# EAGLE board FluoWiFi_R01-RC (EAGLE 8.2.2)
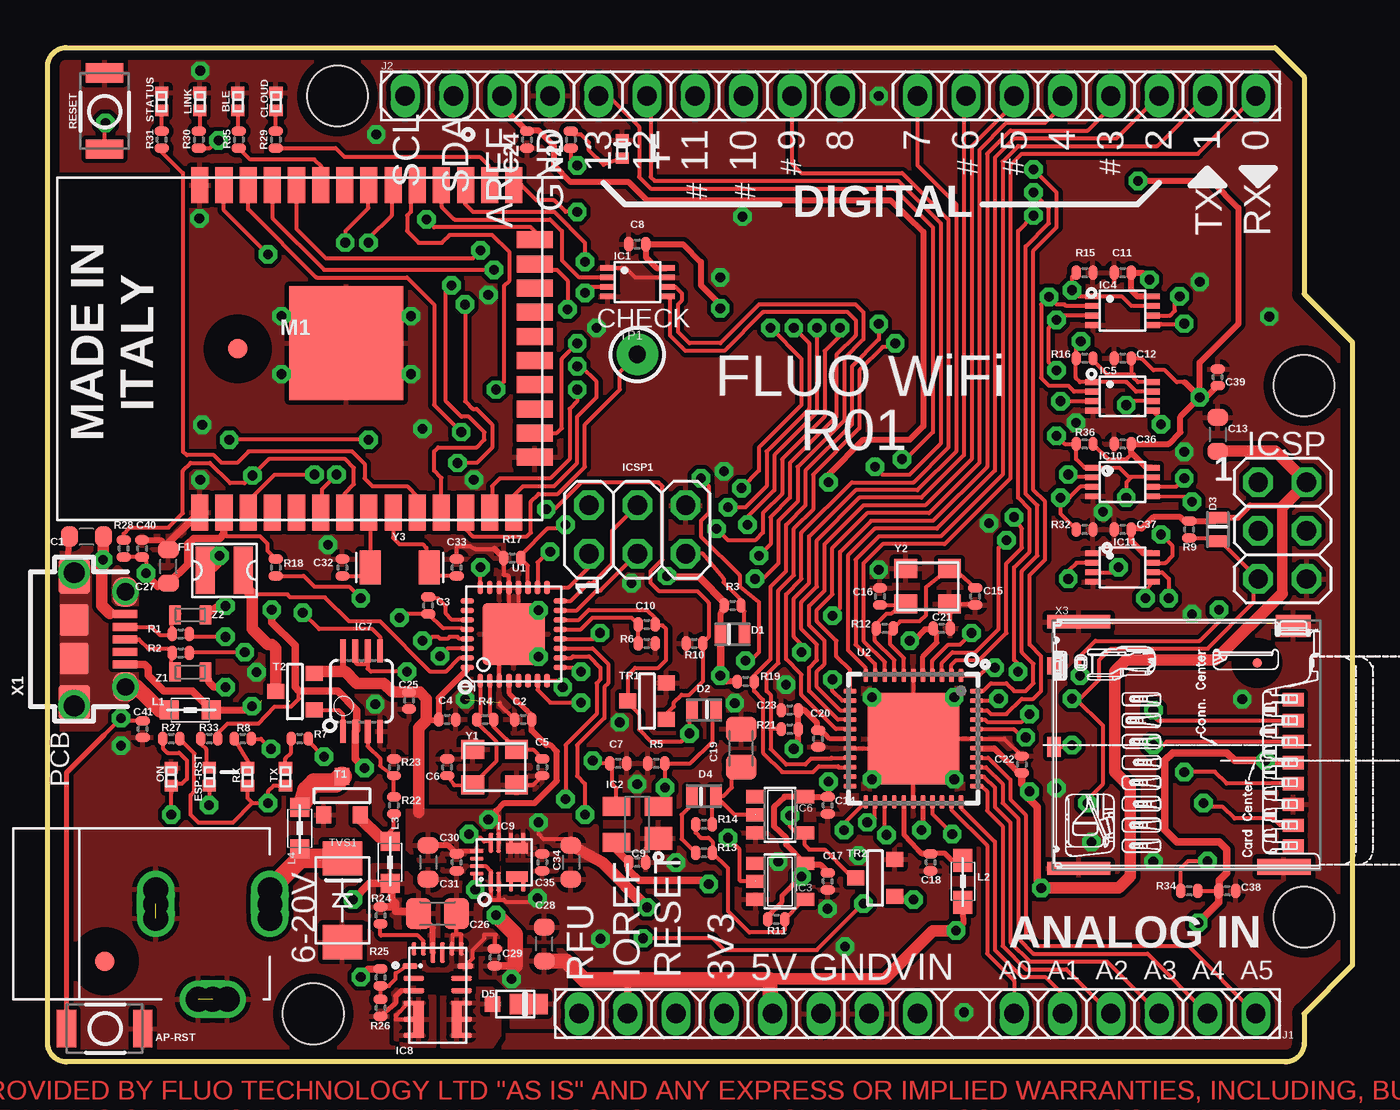
[diagram p2: board, top side]
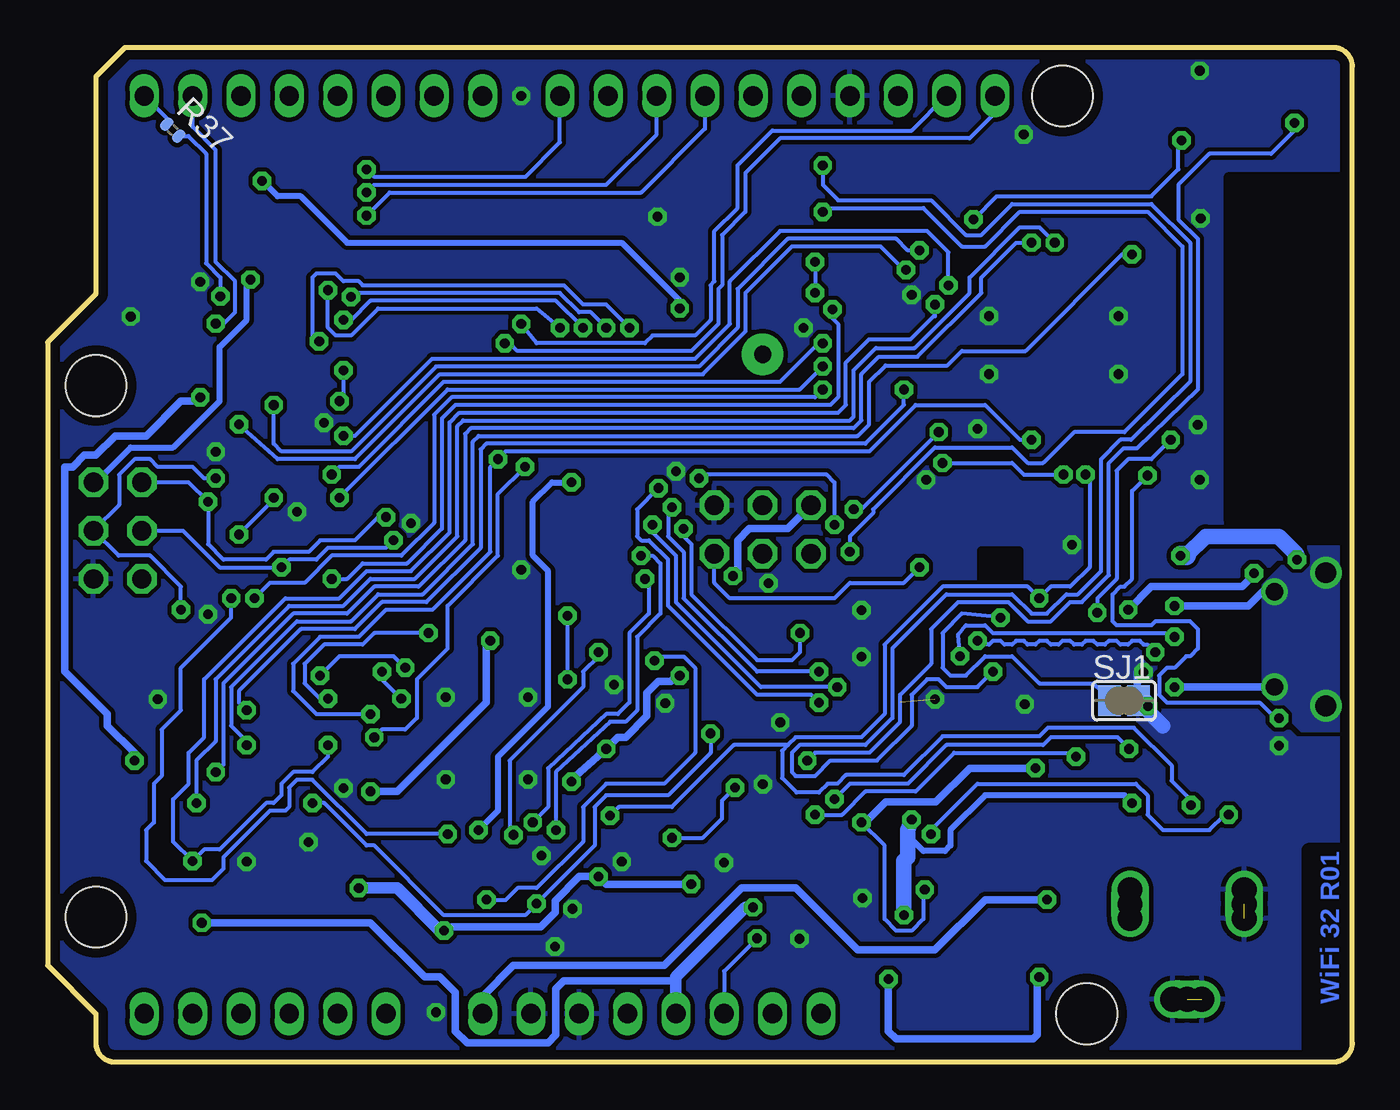
[diagram p3: board, bottom side, seen from below]

Size 68.58 x 53.34 mm. Coordinates in mm from the lower left corner, seen from the top.
Outline: 64.52,53.34 66.04,51.82 66.04,40.39 68.58,37.85 68.58,5.08 66.04,2.54 66.04,1 arc-90 65.04,0 1,0 arc-90 0,1 0,52.34 arc-90 1,53.34 64.52,53.34
Copper layers (1*16): Top 0.035mm / dielectric 1.5mm / Bottom 0.035mm
Design rules "ArduinoUno *": minimum track width 8mil, minimum drill 20mil, track to track 8mil, track to pad 8mil, pad to pad 8mil, via to via 8mil, smd to smd 8mil, copper to edge 20mil, drill to drill 12mil, minimum pad ring 10mil, minimum via ring 9mil, stop-mask expansion 2mil, vias tented up to drill 30mil, thermal gap 10mil
Net classes: 0 default: width 0.203 mm, drill 0.508 mm, clearance 0.203 mm; 1 power: width 0.61 mm, drill 0.508 mm, clearance 0.203 mm; 2 gnd: width 0.203 mm, drill 0.508 mm, clearance 0.203 mm; 3 usbvcc: width 0.305 mm, drill 0.508 mm, clearance 0.203 mm; 4 aref: width 0.305 mm, drill 0.508 mm, clearance 0.203 mm
Holes 3.2 mm at 66.04,35.56 66.04,7.62 15.24,50.8 13.97,2.54
bRestrict: 3 lines
vRestrict: area 22.9,44.1 to 24.6,49.1; area 25.4,45.5 to 27.1,49.1; area 28.4,45.3 to 29.6,48.8; area 31,45.3 to 32.1,48.8; area 33.5,45.3 to 34.7,48.8; area 36.1,45.3 to 37.2,48.8; area 38.7,47.2 to 39.9,48.8; area 40.3,45.1 to 47.6,46.9; area 60.3,44.2 to 61.7,46.7; area 62.9,44.2 to 64.3,46.7; area 61.3,35.8 to 64.8,37.2; area 0.6,21.8 to 2,30.1; area 5.7,22.6 to 7.4,30.1; area 47.9,10.3 to 48.5,10.8; area 50.4,10.2 to 50.9,11; area 11.3,28.8 to 12.7,31.1; area 44.8,47.5 to 46.1,48.9; area 47.6,47.4 to 48.8,48.9; area 50.2,47.4 to 51.3,48.9; area 52.8,47.4 to 54,48.9; area 55.2,47.4 to 56.4,48.9; area 57.9,47.4 to 59.1,48.9; area 60.5,47.4 to 61.6,48.9; area 63,47.4 to 64.1,48.9; area 41.3,47.2 to 42.4,48.8; area 0.3,12.4 to 9.4,24.5

## Footprints (pad centres in the part's own frame; a part is rotated, then mirrored left to right if it is on the bottom)
SMD_157SW = smd 1.016 x 1.981: 1 -2,0; 2 2.001,0
0402_CHIP_LED = smd 0.6 x 0.7: A 0.475,0; C -0.475,0
C0603-ROUND = smd 0.898 x 1.1: 1 -0.889,0; 2 0.889,0
C0402 = smd 0.508 x 0.762: 1 -0.445,0; 2 0.445,0
C0805_ROUND = smd 1.3 x 1.6: 1 -1,0; 2 1,0
0603 = smd 0.6 x 1: A 0.625,0; C -0.625,0
MICROSMP = smd 0.8 x 0.8: A 1.2,0 | smd 2 x 1.1: K -0.7,0
1210 = smd 1 x 2.5: 1 -1,0; 2 1,0
FIDUCIA-MOUNT = smd 1.016 x 1.016: P$1 0,0
MINI-FIDUCIAL = smd 0.508 x 0.508: P$1 0,0
VSSOP8 = smd 0.3 x 0.813: 1 -0.75,-1.55; 2 -0.25,-1.55; 3 0.25,-1.55; 4 0.75,-1.55; 5 0.75,1.55; 6 0.25,1.55; 7 -0.25,1.55; 8 -0.75,1.55
SOT143 = smd 1.2 x 1.44: 1 -0.75,-1.1 | smd 1 x 1.44: 2 0.95,-1.1; 3 0.95,1.1; 4 -0.95,1.1
SOT23-5 = smd 0.69 x 0.99: 1 -0.95,-1.29; 2 0,-1.29; 3 0.95,-1.29; 4 0.95,1.3; 5 -0.95,1.3
MSOP08 = smd 0.3 x 1.2: 1 -0.976,-2.113; 2 -0.326,-2.113; 3 0.324,-2.113; 4 0.974,-2.113; 5 0.974,2.112; 6 0.324,2.112; 7 -0.326,2.112; 8 -0.976,2.112
QFN-20 = smd 0.8 x 0.3: 1 -1.45,1.55; 12 1.45,1.55 | smd 1.1 x 0.275: 2 -1.25,0.9; 10 1.25,0.25; 11 1.25,0.9 | smd 1.1 x 0.25: 3 -1.25,0.25 | smd 0.7 x 0.25: 4 -1.45,-0.4; 5 -1.45,-1.25; 6 -1.45,-2.1; 7 1.45,-2.1; 8 1.45,-1.25; 9 1.45,-0.4 | smd 0.275 x 0.7: 13 1.25,2.45; 14 0.75,2.45; 17 -0.75,2.45; 18 -1.25,2.45 | smd 0.275 x 1.1: 15 0.25,2.25; 16 -0.25,2.25 | smd 0.6 x 1.95: 19 -1,-1.25; 20 1,-1.25
QFN-12 = smd 1.05 x 0.255: 1 -1.025,0.7; 2 -1.025,0.3; 7 1.025,0.3; 8 1.025,0.7 | smd 1.05 x 0.225: 3 -1.025,-0.35; 4 -1.025,-1; 5 1.025,-1; 6 1.025,-0.35 | smd 0.225 x 0.7: 9 0.6,1.45; 10 0.2,1.45; 11 -0.2,1.45; 12 -0.6,1.45 | smd 0.55 x 1.2: 13 -0.75,-0.675; 14 0.75,-0.675
2X03 = drill 1.016 pad 1.55 octagon: 1 -2.54,-1.27; 2 -2.54,1.27; 3 0,-1.27; 4 0,1.27; 5 2.54,-1.27; 6 2.54,1.27
1-14-TH-PRESSFIT = drill 1.02 pad 1.422 long: 1 16.51,0; 2 13.97,0; 3 11.43,0; 4 8.89,0; 5 6.35,0; 6 3.81,0; 7 1.27,0; 8 -1.27,0; 9 -6.35,0; 10 -8.89,0; 11 -11.43,0; 12 -13.97,0; 13 -16.51,0; 14 -19.05,0
1X18-TH-PRESSFIT = drill 1.02 pad 1.422 long: 1 24.384,0; 2 21.844,0; 3 19.304,0; 4 16.764,0; 5 14.224,0; 6 11.684,0; 7 9.144,0; 8 6.604,0; 9 4.064,0; 10 1.524,0; 11 -2.54,0; 12 -5.08,0; 13 -7.62,0; 14 -10.16,0; 15 -12.7,0; 16 -15.24,0; 17 -17.78,0; 18 -20.32,0
0805 = smd 1 x 1: 1 -1.1,0; 2 1.1,0
0805' = smd 1.2 x 1: 1 -1.1,0; 2 1.1,0
WROOM_ESP32 = smd 1.9 x 0.9: 1 0.4,18; 2 0.4,16.73; 3 0.4,15.46; 4 0.4,14.19; 5 0.4,12.92; 6 0.4,11.65; 7 0.4,10.38; 8 0.4,9.11; 9 0.4,7.84; 10 0.4,6.57; 11 0.4,5.3; 12 0.4,4.03; 13 0.4,2.76; 14 0.4,1.49; 25 17.604,1.49; 26 17.604,2.76; 27 17.604,4.03; 28 17.604,5.3; 29 17.604,6.57; 30 17.604,7.84; 31 17.604,9.11; 32 17.604,10.38; 33 17.604,11.65; 34 17.604,12.92; 35 17.604,14.19; 36 17.604,15.46; 37 17.604,16.73; 38 17.604,18 | smd 0.9 x 1.9: 15 3.3,0.4; 16 4.57,0.4; 17 5.84,0.4; 18 7.11,0.4; 19 8.38,0.4; 20 9.65,0.4; 21 10.92,0.4; 22 12.19,0.4; 23 13.46,0.4; 24 14.73,0.4 | smd 6 x 6: PAD 9.3,10.3
R0402 = smd 0.508 x 0.762: 1 -0.445,0; 2 0.445,0
SJ_NO_RESIST = smd 1.168 x 1.6: 1 -0.762,0; 2 0.762,0
SOT-23 = smd 0.787 x 0.889: 1 0.991,1.016; 2 -0.94,1.016; 3 0.025,-1.016
TEST_50 = smd 1.27 x 1.27: 1 0,0
SMA-TVS = smd 1.8 x 2.1: A -2.2,0; K 2.2,0
MLF32 = smd 0.7 x 0.28: 1 -2.45,1.75; 2 -2.45,1.25; 3 -2.45,0.75; 4 -2.45,0.25; 5 -2.45,-0.25; 6 -2.45,-0.75; 7 -2.45,-1.25; 8 -2.45,-1.75; 17 2.45,-1.75; 18 2.45,-1.25; 19 2.45,-0.75; 20 2.45,-0.25; 21 2.45,0.25; 22 2.45,0.75; 23 2.45,1.25; 24 2.45,1.75 | smd 0.28 x 0.7: 9 -1.75,-2.45; 10 -1.25,-2.45; 11 -0.75,-2.45; 12 -0.25,-2.45; 13 0.25,-2.45; 14 0.75,-2.45; 15 1.25,-2.45; 16 1.75,-2.45; 25 1.75,2.45; 26 1.25,2.45; 27 0.75,2.45; 28 0.25,2.45; 29 -0.25,2.45; 30 -0.75,2.45; 31 -1.25,2.45; 32 -1.75,2.45 | smd 3.254 x 3.254: 33 0,0
VQFN44 = smd 0.699 x 0.254: 1 -3.325,2.5; 2 -3.325,2; 3 -3.325,1.5; 4 -3.325,1; 5 -3.325,0.5; 6 -3.325,0; 7 -3.325,-0.5; 8 -3.325,-1; 9 -3.325,-1.5; 10 -3.325,-2; 11 -3.325,-2.5; 23 3.325,-2.5; 24 3.325,-2; 25 3.325,-1.5; 26 3.325,-1; 27 3.325,-0.5; 28 3.325,0; 29 3.325,0.5; 30 3.325,1; 31 3.325,1.5; 32 3.325,2; 33 3.325,2.5 | smd 0.254 x 0.699: 12 -2.5,-3.325; 13 -2,-3.325; 14 -1.5,-3.325; 15 -1,-3.325; 16 -0.5,-3.325; 17 0,-3.325; 18 0.5,-3.325; 19 1,-3.325; 20 1.5,-3.325; 21 2,-3.325; 22 2.5,-3.325; 34 2.5,3.325; 35 2,3.325; 36 1.5,3.325; 37 1,3.325; 38 0.5,3.325; 39 0,3.325; 40 -0.5,3.325; 41 -1,3.325; 42 -1.5,3.325; 43 -2,3.325; 44 -2.5,3.325 | smd 4.826 x 4.826: TH 0,0
CON2_USB_MICRO_B_AT_HOLES = smd 0.406 x 1.346: P1 -1.321,2.675; P2 -0.66,2.675; P3 0,2.675; P4 0.66,2.675; P5 1.321,2.675 | drill 0.9 pad 1.24: P$2 -2.5,2.7; P$7 2.5,2.7 | drill 1.1 pad 1.4: P$3 -3.5,0; P$6 3.5,0 | smd 1.778 x 1.651: S1 -3.302,0; S2 3.302,0 | smd 1.524 x 1.27: S3 -2.489,2.692; S4 2.489,2.692 | smd 1.626 x 1.524: S5 -1.016,0; S6 1.016,0
POWERSUPPLY_DC-21MM = drill 1.3 pad 2 long: 1 -5.08,-3.353; 2 -0.076,-6.35; 3 -0.076,-0.356 | drill 1.3: 4 -5.08,-4.115; 5 -5.08,-2.591; 6 -0.838,-0.356; 7 0.686,-0.356; 8 -0.838,-6.35; 9 0.686,-6.35; 10 -5.08,-3.353; 11 -0.076,-0.356; 12 -0.076,-6.35
20TW877_CARD_CONNECTOR = smd 1.14 x 1.83: GND1 6.26,-6 | smd 0.86 x 2.8: GND2 -6.4,-5.515 | smd 0.7 x 3.3: GND3 6.48,5.265; GND4 -6.48,5.265 | smd 0.7 x 1.1: P1 2.38,-6.015; P2 1.28,-6.015; P3 0.18,-6.015; P4 -0.92,-6.015; P5 -2.02,-6.015; P6 -3.12,-6.015; P7 -4.22,-6.015; P8 -5.32,-6.015 | smd 0.9 x 0.9: P9 4.17,6.465 | smd 1.05 x 0.7: P10 -0.095,6.565
CRYSTAL-3.2-2.5 = smd 1.2 x 1: 1 -1.15,-0.925; 2 1.15,-0.925; 3 1.15,0.925; 4 -1.15,0.925
RESONATOR_EPSON_FC_145 = smd 1.1 x 1.8: P$1 -1.55,0; P$2 1.55,0
CT/CN0603 = smd 0.6 x 1: 1 -0.797,0; 2 0.797,0

## Placement (x,y rotation side)
AP-RST  157SW  [SMD_157SW]  3,1.76 0 top
BLE  BLUE  [0402_CHIP_LED]  10,50.5 270 top
C1  22uF_6V3  [C0603-ROUND]  2.05,27.63 180 top
C2  100nF  [C0402]  25,18 180 top
C3  1uF  [C0402]  20,24 270 top
C4  100nF  [C0402]  21,18 180 top
C5  22pF  [C0402]  26,15.5 270 top
C6  22pF  [C0402]  21,15.5 90 top
C7  100nF  [C0402]  30,15.7 180 top
C8  100nF  [C0402]  31,43 0 top
C9  100nF  [C0402]  31,10.5 0 top
C10  100nF  [C0402]  31.5,23 0 top
C11  100nF  [C0402]  56.5,41.5 180 top
C12  100nF  [C0402]  56.5,37 180 top
C13  22uF_6V3  [C0603-ROUND]  61.5,33 270 top
C14  100nF  [C0402]  41,13.5 90 top
C15  22pF  [C0402]  48.75,24.48 270 top
C16  22pF  [C0402]  43.75,24.48 90 top
C17  100nF  [C0402]  41,9.5 90 top
C18  100nF  [C0402]  46.41,10.5 90 top
C19  10uF_16V  [C0805_ROUND]  36.45,16.5 90 top
C20  100nF  [C0402]  40.5,17 90 top
C21  100nF  [C0402]  47,22.8 180 top
C22  100nF  [C0402]  51.2,15.64 270 top
C23  1uF  [C0402]  39,18.5 180 top
C24  100nF  [C0402]  25.2,48.5 90 top
C25  100nF  [C0402]  19,19 90 top
C26  22uF_25V  [C0805_ROUND]  20.5,7.8 0 top
C27  22uF_6V3  [C0603-ROUND]  6.36,26.05 90 top
C28  22uF_6V3  [C0603-ROUND]  26.11,6.2 90 top
C29  100nF  [C0402]  23.5,5.5 90 top
C30  100nF  [C0402]  21.5,10.5 270 top
C31  22uF_6V3  [C0603-ROUND]  20,10.5 270 top
C32  22pF  [C0402]  15.5,26 90 top
C33  22pF  [C0402]  21.5,26 90 top
C34  22uF_6V3  [C0603-ROUND]  27.5,10.5 270 top
C35  100nF  [C0402]  26,10.5 90 top
C36  100nF  [C0402]  56.5,32.5 180 top
C37  100nF  [C0402]  56.5,28 180 top
C38  1uF  [C0402]  62,9 180 top
C39  1uF  [C0402]  61.5,36 270 top
C40  100nF  [C0402]  4.97,27 270 top
C41  22pF  [C0402]  5,17.5 270 top
CLOUD  WHITE  [0402_CHIP_LED]  12,50.5 270 top
D1  CD0603-SO1575  [0603]  36,22.5 0 top
D2  CD0603-SO1575  [0603]  34.5,18.5 180 top
D3  CD0603-SO1575  [0603]  61.5,28 270 top
D4  CD0603-SO1575  [0603]  34.5,14 0 top
D5  MSS1P3L-M3/89A  [MICROSMP]  24.59,3.05 180 top
DRILEGEND  [DRILEGEND]  73.44,45.84 0 top  (outside the outline)
ESP-RST  SUPER_RED  [0402_CHIP_LED]  8.5,15 90 top
F1  MF-USMF050-2  [1210]  9.3,25.85 180 top
FD1  FIDUCIALMOUNT  [FIDUCIA-MOUNT]  10,37.5 270 top
FD2  FIDUCIALMOUNT  [MINI-FIDUCIAL]  63.57,20.99 0 top
FD3  FIDUCIALMOUNT  [FIDUCIA-MOUNT]  3,5.3 0 top
IC1  74LVC2G125DC  [VSSOP8]  31,41 270 top
IC2  CAT811TTBI-GT3  [SOT143]  31,12.5 90 top
IC3  74LVC1G06DBV  [SOT23-5]  38.5,9.5 270 top
IC4  74LVC2G125DC  [VSSOP8]  56.5,39.5 270 top
IC5  74LVC2G125DC  [VSSOP8]  56.5,35 270 top
IC6  74LVC1G06DBV  [SOT23-5]  38.5,13 270 top
IC7  LMV358IDGKR  [MSOP08]  16.5,19.5 0 top
IC8  MPM3610  [QFN-20]  20.5,3.5 0 top
IC9  MPM3810GQB-33  [QFN-12]  24,10.5 90 top
IC10  74LVC2G125DC  [VSSOP8]  56.5,30.5 270 top
IC11  74LVC2G125DC  [VSSOP8]  56.5,26 270 top
ICSP  ICSP  [2X03]  64.9,27.94 270 top
ICSP1  ICSP  [2X03]  31,28 0 top
J1  FH254-114DF08500V  [1-14-TH-PRESSFIT]  44.45,2.54 180 top
J2  FH254-118DF08500V  [1X18-TH-PRESSFIT]  43.18,50.8 180 top
L  YELLOW  [0402_CHIP_LED]  30.2,48 270 top
L1  MH2029-300Y  [0805]  7.5,18.5 180 top
L2  10uH  [0805']  48.11,9.5 90 top
L3  MH2029-300Y  [0805]  18,10.5 270 top
L4  MH2029-300Y  [0805]  13.26,12.29 90 top
LINK  GREEN  [0402_CHIP_LED]  8,50.5 270 top
M1  ESP32_WROOM_MODULE  [WROOM_ESP32]  26,28.5 90 top
ON  GREEN  [0402_CHIP_LED]  6.5,15 270 top
R1  22R  [R0402]  7,22.5 0 top
R2  22R  [R0402]  7,21.5 0 top
R3  10K  [R0402]  36,24 180 top
R4  1M  [R0402]  23,18 0 top
R5  1M  [R0402]  32,15.7 0 top
R6  1K  [R0402]  31.5,22 180 top
R7  1K  [R0402]  13.25,17 180 top
R8  1K  [R0402]  10.25,17 180 top
R9  10K  [R0402]  60,28 90 top
R10  1M  [R0402]  34,22 180 top
R11  10K  [R0402]  38.3,7.5 180 top
R12  1M  [R0402]  44,22.8 0 top
R13  1K  [R0402]  34.5,11 180 top
R14  200K  [R0402]  34.5,12.5 180 top
R15  1M  [R0402]  54.5,41.5 180 top
R16  1M  [R0402]  54.5,37 180 top
R17  1M  [R0402]  24.42,26.49 180 top
R18  10K  [R0402]  12,26 90 top
R19  10K  [R0402]  36.69,20 180 top
R20  1K  [R0402]  27.5,48.5 270 top
R21  10K  [R0402]  39,17.5 0 top
R22  10K  [R0402]  18.2,13.5 270 top
R23  10K  [R0402]  18.2,15.5 270 top
R24  100k  [R0402]  17.5,7.7 270 top
R25  100k  [R0402]  17.5,4.45 90 top
R26  19K1  [R0402]  17.5,2.85 90 top
R27  1K  [R0402]  6.5,17 0 top
R28  10K  [R0402]  4,27 270 top
R29  1K  [R0402]  12,48.5 270 top
R30  390R  [R0402]  7.95,48.5 270 top
R31  390R  [R0402]  6,48.5 270 top
R32  1M  [R0402]  54.5,28 180 top
R33  390R  [R0402]  8.5,17 0 top
R34  100k  [R0402]  60,9 180 top
R35  390R  [R0402]  10.05,48.5 270 top
R36  1M  [R0402]  54.5,32.5 180 top
R37  1K  [R0402]  62,49 315 bottom
RESET  157SW  [SMD_157SW]  3,50 270 top
RX  YELLOW  [0402_CHIP_LED]  10.5,15 270 top
SJ1  [SJ_NO_RESIST]  12,19 0 bottom
STATUS  GREEN  [0402_CHIP_LED]  6,50.5 270 top
T1  IRLML9301TRPbF  [SOT-23]  15.5,14 180 top
T2  IRLML9301TRPbF  [SOT-23]  13,19.5 270 top
TP1  XXXX_TEST-POINTS_50  [TEST_50]  31,37.21 0 top
TR1  2N7002  [SOT-23]  31.5,19 270 top
TR2  2N7002  [SOT-23]  43.5,9.7 270 top
TVS1  SMAJ18A  [SMA-TVS]  15.5,8.5 90 top
TX  YELLOW  [0402_CHIP_LED]  12.5,15 270 top
U1  ATMEGA16U2-MU  [MLF32]  24.5,22.5 90 top
U2  ATmega644PA-MU  [VQFN44]  45.5,17 270 top
U$1  DISCLAIMER-FLUO  [DISCLAIMER-FLUO]  -18,-18.75 0 top  (outside the outline)
U$2  DISCLAIMER-FLUO  [DISCLAIMER-FLUO]  -18,-18.75 0 top  (outside the outline)
X1  USB MICRO  [CON2_USB_MICRO_B_AT_HOLES]  1.4,22.23 270 top
X2  POWER-SUPPLY  [POWERSUPPLY_DC-21MM]  5.33,8.38 90 top
X3  20TW877  [20TW877_CARD_CONNECTOR]  59.46,16.66 90 top
Y1  16Mhz-KX-7  [CRYSTAL-3.2-2.5]  23.5,15.5 0 top
Y2  16Mhz-KX-7  [CRYSTAL-3.2-2.5]  46.25,25.02 0 top
Y3  32,768Khz_SMD  [RESONATOR_EPSON_FC_145]  18.5,26 180 top
Z1  BRNCG0603MLC-05E  [CT/CN0603]  7.5,20.5 0 top
Z2  BRNCG0603MLC-05E  [CT/CN0603]  7.5,23.5 0 top

## Tracks (layer width: path | path; a pad name or v marks a point on that pad's centre or on a via)
5VEN
  Top 0.203: IC8.17 19.75,6.36 19.46,6.66 17.53,6.66 17.48,6.71 17.48,7.23 R24.2
16U2RXD  (via drill 0.51, 0.51 pad 0.61)
  Top 0.203: v40.44,38.61 40.44,34.14 38.2,31.9 38.2,30.07 36.78,28.65 v36.78,28.25 | U1.8 26.74,20.05 v27.08,19.71 | IC4.3 53.32,39.25 v53.03,39.01 52.63,38.61 52.63,36.78 v53.03,36.37 | v53.24,34.75 IC5.3
  Bottom 0.203: v36.78,28.25 36.78,27.84 35.56,26.62 35.56,24.18 31.09,19.71 v27.08,19.71 | v40.44,38.61 41.86,40.03 51.61,40.03 52.63,39.01 v53.03,39.01 | v53.03,36.37 53.03,34.75 v53.24,34.75
16U2TOATMEGAEN  (via drill 0.51)
  Top 0.203: v41.66,38.61 41.86,38.41 40.84,37.39 40.84,33.93 38.61,31.7 38.61,29.87 37.59,28.85 37.59,27.84 37.19,27.43 35.76,27.43 v35.15,28.04 | U1.12 28.74,22.25 v29.04,22.55 | IC4.7 56.97,39.75 56.49,40.23 54.97,40.23 IC4.1 54.18,40.25 v53.85,40.58 53.85,41.29 R15.2
  Bottom 0.203: v35.15,28.04 35.15,27.64 34.75,27.23 34.75,24.59 31.29,21.13 29.45,21.13 29.04,21.54 v29.04,22.55 | v41.66,38.61 42.88,39.62 51.21,39.62 52.63,38.2 53.44,38.2 53.85,38.61 v53.85,40.58
16U2TOESPEN  (via drill 0.51)
  Top 0.203: v38,38.61 39.62,36.98 39.62,34.54 37.39,32.31 37.39,31.09 v36.47,30.18 | U1.7 25.75,19.56 26.42,18.9 v28.04,18.9 | 54.36,37.9 v54.3,37.9 54.06,37.65 R16.2 54.05,35.97 54.27,35.75 IC5.1 56.68,35.75 56.69,35.76 57.21,35.25 IC5.7
  Bottom 0.203: v28.04,18.9 28.45,19.3 31.29,19.3 35.97,23.98 35.97,26.42 36.98,27.43 37.39,27.43 37.59,27.64 37.59,29.06 v36.47,30.18 | v38,38.61 39.22,39.83 40.44,39.83 41.45,40.84 52.02,40.84 52.22,41.05 53.03,41.05 53.44,41.45 54.46,41.45 54.66,41.25 54.66,38.15 v54.3,37.9
16U2TXD  (via drill 0.51)
  Top 0.203: U1.9 27.82,20.75 v28.04,20.52 | v39.22,38.61 40.03,37.8 40.03,34.34 37.8,32.11 37.8,30.28 36.68,29.16 v35.76,29.16 | IC4.2 53.52,39.75 53.44,39.83 53.03,39.83 v52.63,40.23 52.22,39.83 52.22,35.97 52.63,35.56 53.65,35.56 53.95,35.25 IC5.2
  Bottom 0.203: 52.85,40.23 v52.63,40.23 52.43,40.44 41.66,40.44 40.64,39.42 40.03,39.42 v39.22,38.61 | v35.76,29.16 35.97,28.96 35.97,27.64 35.15,26.82 35.15,24.38 31.29,20.52 v28.04,20.52
644RX5  (via drill 0.51)
  Top 0.203: v37.19,25.4 37.59,25.4 38.41,26.21 38.41,28.45 39.42,29.46 39.42,31.29 41.86,33.73 41.86,36.98 42.88,38 42.88,39.42 42.47,39.83 37.39,39.83 35.36,37.8 33.73,37.8 33.12,38.41 33.12,39.83 33.33,40.03 33.33,40.44 33.01,40.75 IC1.6 | v43.08,12.6 43.28,12.6 43.48,12.8 43.48,13.66 U2.24
  Bottom 0.203: v37.19,25.4 36.98,25.2 36.98,23.57 38,22.55 38,18.9 38.61,18.29 39.22,18.29 42.27,15.44 42.27,13.41 v43.08,12.6
644TX5  (via drill 0.51)
  Top 0.203: v37.39,26.62 38,27.23 38,28.65 39.01,29.67 39.01,31.5 41.45,33.93 41.45,37.19 42.47,38.2 42.47,39.01 42.06,39.42 37.59,39.42 35.56,37.39 33.53,37.39 32.72,38.2 32.72,40.09 IC1.5 | v41.86,12.19 41.86,12.53 U2.23
  Bottom 0.203: v37.39,26.62 36.78,26.62 36.37,26.21 36.37,23.57 37.59,22.35 37.59,18.49 38.2,17.88 39.01,17.88 41.86,15.24 v41.86,12.19
+3V3  (via drill 0.51)
  Top 0.203: R28.2 | 27.5,11.72 26.08,11.72 25.81,11.99 v25.81,12.6 | IC9.14 24.62,11.25 IC9.6 | IC9.12 22.45,9.9 22.45,9.09 v22.48,9.07 | R28.2 C40.2 5.18,26.34 v5.18,25.7 | R34.1 C38.2 | IC5.8 57.32,35.75 57.1,35.97 57.1,36.17 56.9,36.17 | R16.1 54.94,36.9 55.68,36.17 56.9,36.17 | 56.9,36.17 56.94,36.22 C12.1 56.96,36.98 57.51,36.98 58.12,36.37 58.73,36.37 59.35,35.75 59.75,35.75 | 9.27,27.76 9.4,27.64 11.18,27.64 11.56,27.26 11.56,26.89 R18.2 | 13.21,19.51 13.21,19.1 12.8,18.69 11.94,18.69 11.07,17.78 9.45,17.78 8.94,17.28 R33.2 | R36.1 55.74,31.7 56.69,31.7 57,32
  Top 0.305: C34.1 27.5,11.72 | 16.26,17.47 IC7.2 | v57.3,46.33 61.16,46.33 62.59,44.91 62.59,38.81 60.55,36.78 v60.55,34.95 | C39.2 60.91,35 v60.55,34.95 | v60.55,34.95 59.54,33.93 59.54,33.12 58.92,32.5 C36.1 56.94,32.06 57,32 57.75,31.25 IC10.8 | X3.P4 64.11,15.74 v64.01,15.85 | v35.36,39.62 35.36,39.83 34.34,40.84 34.34,42.06 33.4,43 C8.2 31.45,42.32 32.01,41.75 IC1.8 | 59.75,35.75 v60.55,34.95
  Top 0.406: 16.26,17.47 16.26,18.49 15.24,19.51 13.21,19.51 13.01,19.71 13.01,21.89 11.79,23.11 v11.79,23.77 | v5.18,25.7 5.18,25.6 5.79,25 C27.1 7.37,26.16 7.37,27.23 7.67,27.53 9.04,27.53 9.27,27.76 M1.2 | IC7.2 16.17,15.93 v16.66,15.44 | 63.8,15.85 v64.01,15.85 62.38,15.85 61.98,16.26 59.13,16.26 58.73,15.85 58.73,12.19 59.33,11.58 61.57,11.58 61.98,11.18 61.98,9.96 61.57,9.55 61.57,8.99 C38.2 61.56,8.39 v60.48,7.32
  Top 0.61: C34.1 29.14,10.48 v31.5,8.13
  Bottom 0.203: v22.48,9.07 22.55,8.99 22.55,7.52 23.16,6.91 23.98,6.91 24.59,7.52 24.59,11.38 v25.81,12.6
  Bottom 0.305: v57.3,46.33 56.49,45.52 55.27,45.52 52.83,43.08 38.41,43.08 35.36,40.03 v35.36,39.62
  Bottom 0.406: v11.79,23.77 10.57,24.99 5.79,24.99 5.18,25.6 v5.18,25.7 | v60.48,7.32 51.61,7.32 48.77,4.47 47.95,4.47 47.14,3.66 47.14,1.63 46.53,1.02 42.27,1.02 41.86,1.42 41.86,3.86 41.45,4.27 35.76,4.27 35.56,4.06 | v25.81,12.6 25.6,12.6 24.54,13.66 21.89,13.66 20.12,15.44 v16.66,15.44 | v64.01,15.85 64.01,16.26 65.43,17.68 65.43,18.29 67.67,20.52 67.67,31.29 67.26,31.29 66.65,31.9 66.04,31.9 65.02,32.92 63.4,32.92 61.57,34.75 60.76,34.75 v60.55,34.95
  Bottom 0.61: J1.4 35.56,4.06 35.56,4.47 31.9,8.13 v31.5,8.13
  pour Top (isolate 0.203, rank 2): 24.18,13 28.24,13 28.85,12.4 28.85,10.57 24.18,10.57
+5V  (via drill 0.51)
  Top 0.203: 7.08,16.87 R27.2 7.72,16.22 7.72,14.22 7.52,14.02 7.52,13.01 7.92,12.6 9.75,12.6 10.77,13.61 | 11.61,13.64 v11.58,13.61 | RX.A 10.5,13.88 10.77,13.61 | 10.77,13.61 v11.58,13.61 | TX.A 11.88,14.53 11.58,14.22 v11.58,13.61
  Top 0.229: IC9.7 23.7,12.88
  Top 0.254: 23.7,12.88 23.57,13.01 23.16,13.01 | U2.5 46,21.31 46.74,22.05 46.74,22.62 C21.2 | U2.17 41.12,17 40.84,17.27 40.67,17.27 C20.2 | U1.4 24.25,19.41 25.2,18.49 25.45,18.24 C2.1 | R11.2 37.85,7.68 38.61,8.43 38.61,8.74 v39.62,9.75 | C30.1 21.66,11.1 IC9.9
  Top 0.305: 64.95,29.26 63.2,29.26 62.56,28.62 D3.C 61.32,28.45 R9.2 59.74,28.45 59.54,28.65 58.11,28.65 57.51,28.04 56.99,28.04 C37.1 56.94,27.38 57.58,26.75 IC11.8 | U1.32 22.05,20.63 20.55,19.13 C4.2 20.52,17.97 19.91,17.97 | U2.38 49.74,16.5 51,15.24 C22.2 | v45.31,22.15 45.52,22.15 46.13,22.76 46.51,22.76 C21.2 | v39.22,16.46 39.42,16.66 39.42,17.48 R21.2 C23.1 39.77,18.5 40.44,17.82 40.44,17.5 C20.2 | R19.2 35.68,20 35.38,20.3 v35.36,20.32 | 23.57,13.01 23.57,13.21 23.98,13.61 25.6,13.61 26.77,14.78 26.77,16.31 26.42,16.66 26.21,16.66 25.45,17.43 C2.1 | v41.05,14.73 41.05,13.94 C14.2 IC6.5 38.74,13.95 38.18,13.41 38.18,12.39 38.81,11.79 38.81,11.44 IC3.5 | D1.C 35.38,23.52 R3.2 | v57.91,41.14 57.55,41.5 C11.1 56.94,40.59 57.29,40.25 IC4.8 | v47.75,6.91 48.14,7.32 L2.1 | C30.1 21.05,11.39 C31.1 | v39.62,9.75 39.62,10.27 IC3.5 | C17.2 41,10 40.64,10.36 39.89,10.36 IC3.5 | IC3.5 | IC7.8 15.52,20.6 15.44,20.52
  Top 0.406: 64.95,29.26 ICSP.2 | v16.46,4.47 16.86,4.88 R25.2 | J1.2 30.48,4.27 28.19,4.32 | C29.1 24.56,5.06 24.59,5.08 | v23.16,12.75 23.16,13.01 | IC2.4 29.9,11.15 C9.1 30.55,10.09 31.09,9.55 34.54,9.55 v34.75,9.35 | C22.2 51.2,14.63 v51.61,14.22 51.61,13.82 52.02,13.41 52.02,9.55 52.22,9.35 v52.22,9.14 | 35.38,20.3 D1.C | v32.56,25.55 32.61,25.55 32.66,25.5 34.24,25.5 35.65,24.09 R3.2
  Top 0.559: 64.9,24.64 64.9,29.18
  Top 0.61: 37.95,4.32 38.1,4.37 43.99,4.37 46.53,6.91 v47.75,6.91 | v52.22,9.14 56.29,9.14 56.9,9.75 56.9,14.43 56.08,15.24 56.08,20.52 56.69,21.13 61.37,21.13 64.9,24.64 | 64.9,29.18 ICSP.2 64.54,32.11 C13.2 | 19.51,13.13 19.51,17.56 19.91,17.97 19.91,19.1 19.57,19.45 C25.2 18.15,19.45 17.68,19.91 16.26,19.91 15.65,20.52 15.44,20.52 14.1,20.52 T2.2
  Top 0.813: C28.1 27.25,5.3 28.19,4.32 37.95,4.32 38,2.64 J1.5 | 24.59,5.08 24.59,6.71 v23.57,7.72
  Bottom 0.305: v11.58,13.61 11.99,14.02 19.3,14.02 21.13,12.19 21.13,11.38 21.41,11.1 IC9.9 23.16,11.71 v23.16,12.75 | ICSP1.2 28.46,29.25 | v57.91,41.14 58.12,40.94 58.12,39.01 59.54,37.59 59.54,34.75 61.98,32.31 64.21,32.31 66.04,30.48
  Bottom 0.406: v24.38,4.37 24.38,1.63 23.98,1.22 16.76,1.22 16.56,1.42 16.56,4.37 v16.46,4.47 | v47.75,6.91 47.35,7.11 42.67,7.11 41.91,7.87 41.91,8.48 40.64,9.75 v39.62,9.75 39.22,9.35 v34.75,9.35 | v51.61,14.22 50.19,14.22 45.52,18.9 45.52,21.95 v45.31,22.15 | 28.46,29.25 29.67,28.04 31.7,28.04 32.31,27.43 32.31,25.81 v32.56,25.55 | v35.36,20.32 35.52,20.32 35.84,20 36.49,20 37.08,19.41 37.08,18.19 38.2,17.07 38.61,17.07 v39.22,16.46 41.05,14.83 v41.05,14.73 | ICSP.2 66.04,30.48
  Bottom 0.61: v52.22,9.14 50.19,9.14 47.95,6.91 v47.75,6.91
  Bottom 0.813: v23.57,7.72 23.57,10.57 23.37,10.77 23.37,12.19 v23.16,12.75
  pour Top (rank 2): 22.76,5.49 24.18,5.49 24.59,5.89 27.03,5.89 27.23,5.69 27.23,1.83 24.38,1.83 24.38,3.66 23.62,4.42 22.76,4.42
  pour Top (isolate 0.203): 18.9,13.21 18.9,11.2 19.53,10.57 20.93,10.57 21.13,10.36 23.77,10.36 23.77,13.21
+5V_SEZ
  pour Top (isolate 0.203): 20.73,3.86 20.73,0.81 23.37,0.81 23.77,1.42 23.77,3.45 23.37,3.86
++VIN  (via drill 0.51)
  Top 0.305: IC8.16 20.25,7.05 C26.1
  Top 0.406: R24.1 18.27,8.15 18.29,7.92 | 18.29,7.92 18.29,8.33 18.09,8.53 18.09,9.31 L3.2 16.92,9.4 v16.05,8.53 | 19.1,7.92 18.29,7.92
  Top 0.61: C26.1 19.22,7.8 19.1,7.92
  Bottom 0.406: J1.8 45.72,3.45 44.09,5.08 36.17,5.08 32.11,9.14 29.26,9.14 26.01,5.89 21.95,5.89 19.3,8.53 v16.05,8.53
  pour Top: 17.07,10.36 18.47,10.36 19.1,9.73 19.1,9.35 19.71,8.74 20.12,8.74 20.52,8.33 20.52,6.3 20.32,6.1 20.12,6.1 19.91,6.3 19.91,6.71 19.71,6.91 18.49,6.91 18.29,7.11 18.29,7.52 18.08,7.72 17.07,7.72
+VIN
  Top 0.203: L3.1 17.98,12.09 18.2,12.31 R22.2
  Top 0.61: T1.2 16.44,12.82 17.48,11.79 17.82,11.6 L3.1
AD0
  Top 0.203: U2.32 47.5,13.26 49.38,11.38 49.38,5.69 50.8,4.27 J1.9
AD1
  Top 0.203: U2.33 48,13.37 49.78,11.58 49.78,5.89 51.21,4.47 52.43,4.47 53.24,3.66 53.24,2.64 J1.10
AD2
  Top 0.203: U2.34 49.1,14.5 49.38,14.22 49.38,13.21 50.19,12.39 50.19,6.1 51.41,4.88 53.54,4.88 J1.11
AD3
  Top 0.203: U2.35 49.21,15 49.78,14.43 49.78,13.41 50.6,12.6 50.6,6.3 51.61,5.28 55.68,5.28 J1.12
AD4
  Top 0.203: U2.36 49.32,15.5 50.19,14.63 50.19,13.61 51,12.8 51,6.5 51.82,5.69 57.81,5.69 J1.13
AD5
  Top 0.203: U2.37 49.43,16 50.6,14.83 50.6,13.82 51.41,13.01 51.41,6.71 52.02,6.1 59.94,6.1 J1.14
AREF  (via drill 0.51)
  Top 0.254: U2.29 46,12.32 v45.92,12.19
  Top 0.305: 23.88,50.27 C24.2 | v41.05,30.48 41.05,30.89 42.88,32.72 45.31,32.72 46.02,33.43 46.02,43.64 44.3,45.31 31.5,45.31 30.53,46.28 27.48,46.28 26.62,47.14 26.62,48.16 25.81,48.97 25.23,48.97
  Top 0.406: J2.3 23.88,50.27 | 25.23,48.97 C24.2
  Bottom 0.305: 46.13,12.19 v45.92,12.19 44.91,13.21 44.91,16.05 42.27,18.69 42.27,25.81 43.08,26.62 43.08,29.46 42.06,30.48 v41.05,30.48
ATMEGAINT3  (via drill 0.51)
  Top 0.203: 55.03,26.25 IC11.2 54.09,26.25 53.65,25.81 v53.65,25.4 | 25.5,41.96 M1.23 25.9,41.66 26.77,41.66 27.33,41.1 v27.33,39.57
  Bottom 0.203: v53.65,25.4 52.83,25.4 52.02,26.21 49.68,26.21 47.85,28.04 47.85,33.83 47.14,34.54 27.43,34.54 27.03,34.95 27.03,38.81 27.33,39.12 v27.33,39.57
ATMEGARESET  (via drill 0.51)
  Top 0.203: R9.1 61.32,27.55 D3.A 61.65,27.38 ICSP.5 63.4,25.17 63.4,24.18 60.98,21.74 55.88,21.74 55.27,21.13 55.27,20.12 54.25,19.1 54.05,19.1 | U2.4 46.5,21.1 47.35,21.95 47.95,21.95 v48.56,22.55 | 33.85,18.02 D2.A 33.88,18.35 33.73,18.09 v33.73,17.27 33.33,16.87 31.7,16.87 31.09,17.48 31.09,18.29 30.59,18.79 TR1.3 30.57,18.99 30.48,19.1 30.48,20.32 30.89,20.73 32.11,20.73 32.51,21.13 32.51,22.76 32.31,22.96 31.98,22.96 C10.2 31.9,23.04 31.9,23.37 31.5,23.77 28.45,23.77 27.92,23.25 U1.14 | v54.66,13.61 54.66,13.82 55.47,14.63 55.47,17.68 54.05,19.1 | v53.85,19.1 54.05,19.1 | v42.88,8.33 40.44,5.89 35.56,5.89 34.95,6.5 v31.29,6.5
  Bottom 0.203: v54.66,13.61 54.05,13.61 51.82,11.38 51.41,11.38 47.75,7.72 43.48,7.72 v42.88,8.33 39.83,11.38 39.83,13.41 39.22,14.02 35.97,14.02 33.73,16.26 v33.73,17.27 | v48.56,22.55 51.41,22.55 52.02,21.95 54.05,21.95 55.07,20.93 55.07,19.91 54.25,19.1 v53.85,19.1 | v31.29,6.5 33.02,4.78 J1.3
ATMEGARSTCMD  (via drill 0.51)
  Top 0.203: TR1.1 32.22,18 32.92,18.69 32.92,18.9 33.33,19.3 33.73,19.3 34.44,20.02 R10.1 34.58,22.19 34.75,22.35 34.75,24.16 34.16,24.74 32.16,24.74 31.7,25.2 31.7,25.81 32.31,26.42 32.31,30.28 32.11,30.48 28.04,30.48 26.62,29.06 v26.21,29.06 | 10.54,45.75 M1.36 10.54,44.83 14.12,41.25 18.9,41.25 20.32,39.83 20.32,34.54 v21.74,33.12
  Bottom 0.203: v26.21,29.06 25.81,29.06 v21.74,33.12
ATMEGINT  (via drill 0.51)
  Top 0.203: U2.30 46.5,13.04 v47.55,11.99 | 57.86,25.75 IC11.6 58.58,25.75 58.93,25.4 v58.93,24.38
  Bottom 0.203: v47.55,11.99 51.82,11.99 54.66,14.83 55.47,14.83 55.88,14.43 55.88,13.41 56.08,13.21 56.9,13.21 59.33,10.77 59.33,10.16 59.94,9.55 62.38,9.55 63.4,10.57 63.4,12.19 62.99,12.6 62.99,14.63 62.59,15.04 62.59,17.48 61.57,18.49 61.57,20.73 58.93,23.37 v58.93,24.38
AVCC
  Top 0.203: L2.2 47.5,10.62
  Top 0.254: U2.27 45,11.94 45.72,11.18 45.95,10.94 C18.2 46.03,10.97 47.14,10.97 47.5,10.62
BLELED
  Top 0.203: R35.2 10.66,47.45 14.02,47.45 14.38,47.09 14.38,46.13 M1.33
BUTTON  (via drill 0.51)
  Top 0.203: 2.98,17.2 v3.86,18.09 4,17.95 C41.1 | R28.1 4,27.77 4.32,28.09 6.35,28.09 7.11,28.85 7.11,31.09 7.52,31.5 8.53,31.5 9.6,30.43 10.36,30.43 v10.77,30.84 11.63,31.7 15.65,31.7 16.1,31.24 16.1,30.38 15.62,29.89 M1.7
  Top 0.254: AP-RST.1 1,15.22 2.98,17.2
  Bottom 0.203: v3.86,18.09 4.06,18.09 4.88,18.9 9.75,18.9 10.16,19.3 10.16,20.32 9.75,20.73 9.35,20.73 8.74,21.34 8.53,21.34 8.13,21.74 8.13,22.76 8.53,23.16 10.36,23.16 10.57,22.96 12.39,22.96 12.6,23.16 12.6,24.59 12.19,24.99 11.99,24.99 11.58,25.4 11.58,30.02 v10.77,30.84
CMP
  Top 0.203: R22.1 R23.2 17.48,15.58 17.48,15.95 16.82,16.6 IC7.3
D+
  Top 0.203: X1.P3 4.8,22.23 5.28,21.74 6.31,21.74 R2.1 6.5,20.95 Z1.1
D-
  Top 0.203: 6.93,23.57 Z2.1 6.5,23.05 R1.1 6.51,22.45 5.89,22.45 5.46,22.89 X1.P2
DTR
  Top 0.203: R6.2 C10.1 30.69,23.37 28.65,23.37 28.03,22.75 U1.13
ESPEN  (via drill 0.51, 0.51 pad 0.61)
  Top 0.203: 10.54,29.03 M1.3 10.54,29.49 11.94,30.89 v14.02,30.89 | 42.39,9.47 TR2.3 42.06,9.9 42.06,9.96 40.84,11.18 40.03,11.18 39.8,11.41 IC6.4 39.36,12.05 39.01,12.39 v39.01,12.95 | v16.46,24.38 15.85,24.99 14.02,24.99 13.46,25.55 R18.1 | ESP-RST.C 8.5,13.92 v8.48,13.51
  Bottom 0.203: 29.67,16.66 29.26,17.07 25.81,17.07 24.59,18.29 24.59,21.95 21.54,24.99 17.07,24.99 v16.46,24.38 15.85,24.99 14.83,24.99 13.82,26.01 13.82,30.68 v14.02,30.89 | 29.67,16.66 32.51,16.66 35.76,13.41 38.56,13.41 v39.01,12.95 | 29.67,16.66 29.97,16.36 29.97,14.94 29.21,14.17 28.04,14.17 27.58,14.63 27.08,14.63 26.62,15.09 23.57,15.09 21.54,17.12 16.46,17.12 16,17.58 11.48,17.58 9.5,15.6 9.5,14.78 8.53,13.82 v8.48,13.51
ESPENCMD  (via drill 0.51)
  Top 0.203: v27.23,28.25 27.03,28.04 26.27,28.04 24.86,26.64 R17.1 25.25,26.11 U1.19 | v34.34,30.68 34.75,30.28 34.75,28.85 34.34,28.45 34.34,27.64 36.37,25.6 36.37,24.99 37.39,24.18 37.39,21.54 36.98,21.13 v36.69,21.1 | v45.52,8.53 44.54,8.53 TR2.1
  Bottom 0.203: v34.34,30.68 34.14,30.89 27.64,30.89 27.23,30.48 v27.23,28.25 | v45.52,8.53 45.29,8.51 44.52,8.51 43.88,9.14 42.88,9.14 40.44,11.58 40.44,13.41 39.22,14.63 36.17,14.63 34.54,16.26 34.54,20.73 35.12,21.3 36.41,21.3 36.58,21.13 v36.69,21.1
ESPINTRX3  (via drill 0.51)
  Top 0.203: 21.97,46.3 M1.27 21.95,46.08 21.95,45.11 22.35,44.7 26.62,44.7 28.25,43.08 28.25,42.47 28.25,42.26 v28.25,42.06 | IC1.3 28.56,40.75 v28.25,40.44
  Bottom 0.203: v28.25,42.06 v28.25,40.44
ESPINTTX3
  Top 0.203: 20.7,46.15 M1.28 20.73,46.08 20.73,44.96 21.39,44.3 26.42,44.3 27.03,43.69 27.03,42.17 27.95,41.25 IC1.2
ESPRX3  (via drill 0.51)
  Top 0.203: M1.34 13.08,43.82 14.63,42.27 22.35,42.27 v22.76,42.67 | IC5.6 56.9,34.75 v56.69,34.54
  Bottom 0.203: v22.76,42.67 23.37,42.67 23.98,43.28 29.67,43.28 32.31,40.64 32.31,38.61 34.34,36.58 48.16,36.58 52.63,32.11 56.29,32.11 56.69,32.51 v56.69,34.54
ESPTX3  (via drill 0.51)
  Top 0.203: M1.35 11.81,44.38 14.53,41.66 v23.47,41.66 | IC5.5 58.52,33.78 v58.52,33.53
  Bottom 0.203: v58.52,33.53 56.49,31.7 52.43,31.7 47.95,36.17 34.14,36.17 31.9,38.41 31.9,40.44 29.46,42.88 24.79,42.88 23.57,41.66 v23.47,41.66
GATECMD
  Top 0.203: IC7.1 15.52,18.29 15.3,18.51 T2.1
GND  (via drill 0.51)  (4 unrouted)
  Top 0.203: 17.59,2.49 R26.1 | U1.3 23.75,21.75 U1.33 24.56,22.5 v25.81,23.75 25.78,23.77 24.79,23.77 24.75,23.82 U1.20 | U2.6 U2.TH | U2.TH U2.39 50.28,17 C22.1 | U2.TH 45,16.5 | U2.28 45.5,16 45,16.5 | 23.77,8.53 23.37,8.53 23.3,8.6 IC9.1 23.3,10.03 23.02,10.3 IC9.11 | 23.77,8.53 23.98,8.53 24.08,8.43 25.58,8.43 v25.76,8.61 | IC9.2 23.7,8.61 23.77,8.53 | IC8.12 22.35,5.45 22.35,5.89 22.96,6.5 22.96,6.71 23.57,6.71 23.5,6.63 C29.2 | C21.1 47.44,23.8 Y2.2 47.46,24.09 47.95,24.09 48.45,24.09 C15.2 | Y1.2 25.52,14.57 C5.2 | C2.2 23.77,18.78 23.77,18.9 | U2.18 44.7,16.5 | 44.7,16.5 45,16.5 | v43.33,14.86 43.33,15.13 44.7,16.5 | R17.2 23.97,25.61 23.98,25.6 24.18,25.6 24.23,25.55 24.23,23.67 | C33.2 21.5,27.09 21.54,27.13 22.2,27.13 22.45,26.98 23.49,26.98 | C11.2 56.06,41.01 | 21.29,5.94 21.29,6.71 21.49,6.71 | IC8.13 21.74,6.71 21.49,6.71 | 21.49,6.71 21.49,7.37 | IC1.7 30.89,41.25 30.39,41.75 IC1.1
  Top 0.254: IC8.3 18.58,3.75 18.29,3.45 18.29,3.1 18.09,2.9 17.59,2.49
  Top 0.305: 23.49,26.98 R17.2 | C40.1 5.96,27.45 C27.2
  Top 0.406: M1.1 7.57,28.5 6.3,27.23 6.23,27.23 C27.2
  Bottom 0.406: 11.32,18.79 11.32,20.51
  Bottom 0.813: 9.96,17.68 11.18,18.9
  other vias: 8.03,52.12 17.27,48.77 19.1,36.17 19.1,39.22 12.29,39.22 12.29,36.17 47.65,19.18 14.73,27.2 8.03,30.61 8.13,33.5 43.69,50.8 33.02,10.49 42.62,10.85 58.12,10.54 54.86,11.56 29.06,6.48 10.97,20.5 30.99,14.61 41,8.05 38.4,10.54 47.65,14.86 43.33,19.18 38.81,19.84 53.04,14.4 49.48,28.32 59.74,32.08 60.15,23.55 55.47,28.93 54.05,33.6 43.68,25.88 36.12,18.87 30.68,25.17 17.22,18.82 21.95,19.08 25.81,21.31 60.55,41.02 22.4,30.61 41.91,6.07 64.21,39.19 35.56,31.06 36.53,44.45 62.79,19.08 48.16,2.62 35.36,41.25 23.16,40.34 28.85,38.61 30.07,17.86 3.86,16.64 19.71,33.3 7.98,44.35
  pour Bottom (isolate 0.229, rank 3): -1.02,54.36 69.6,54.36 69.6,-1.02 -1.02,-1.02
  pour Top (isolate 0.229, rank 3): -0.51,53.85 69.09,53.85 69.09,-0.51 -0.51,-0.51
GPIO0  (via drill 0.51)
  Top 0.203: v27.84,44.7 27.23,44.7 26.62,45.31 25.7,45.31 24.91,46.1 M1.25 | U1.18 25.75,26.27 26.3,26.82 v26.42,26.82
  Bottom 0.203: v27.84,44.7 27.64,44.91 22.55,44.91 20.52,42.88 19.3,42.88 17.48,44.7 10.77,44.7 8.94,42.88 8.94,36.17 11.99,33.12 14.63,33.12 16.26,31.5 17.07,31.5 17.88,32.31 21.95,32.31 25.2,29.06 25.2,28.85 26.42,27.64 v26.42,26.82
INTERNETLED
  Top 0.203: 23.16,46.58 M1.26 23.16,46.18 23.16,47.14 22.71,47.59 15.6,47.59 15.14,48.06 R29.2
IO0/RX
  Top 0.203: U2.9 44,21.02 42.88,22.15 42.88,26.21 43.89,27.23 47.14,27.23 50.6,30.68 50.6,47.14 51.21,47.75 60.45,47.75 J2.18
  Bottom 0.203: R37.1 62.31,49.61 J2.18
IO0RX  (via drill 0.51)
  Top 0.203: IC4.6 59,39.25 59.25,39.5 59.25,40 v59.5,40.25
  Bottom 0.203: R37.2 61.19,48.69 60.25,47.75 60.25,42 59.5,41.25 v59.5,40.25
IO1/TX  (via drill 0.51)
  Top 0.203: U2.10 43.48,20.34 43.48,20.93 42.47,21.95 42.47,26.42 43.69,27.64 46.94,27.64 50.19,30.89 50.19,47.35 51,48.16 58.32,48.16 J2.17 | IC4.5 58.44,38.73 58.52,38.81 59.93,38.81 v59.74,38.83
  Bottom 0.203: v59.74,38.83 59.32,38.83 58.73,39.42 58.73,41.05 59.74,42.06 59.74,47.95 60.96,49.17 J2.17
IO2
  Top 0.203: U2.11 43,20.73 42.06,21.67 42.06,26.62 43.48,28.04 46.74,28.04 49.78,31.09 49.78,47.55 50.8,48.56 56.19,48.56 J2.16
IO3  (via drill 0.51)
  Top 0.203: J2.15 55.88,50.19 54.66,48.97 50.6,48.97 49.38,47.75 49.38,31.29 46.53,28.45 43.28,28.45 41.66,26.82 41.66,23.88 v41.25,23.47 | U2.13 41.76,19 41.25,19.51 v41.25,20.12
  Bottom 0.203: v41.25,20.12 v41.25,23.47
IO4
  Top 0.203: J2.14 53.34,50.29 52.43,49.38 50.39,49.38 48.97,47.95 48.97,31.5 46.33,28.85 43.08,28.85 41.25,27.03 41.25,24.59 40.44,23.77 40.44,23.16 41.45,22.15 41.45,21.34 42.17,20.61 U2.12
IO5
  Top 0.203: J2.13 50.8,50.39 48.56,48.16 48.56,31.7 46.13,29.26 42.88,29.26 40.84,27.23 40.84,24.79 40.03,23.98 40.03,22.96 40.84,22.15 40.84,20.93 40.44,20.52 40.44,19.71 41.66,18.49 U2.14
IO6
  Top 0.203: J2.12 48.26,50.7 48.16,50.6 48.16,31.9 45.92,29.67 42.67,29.67 40.44,27.43 40.44,24.99 39.62,24.18 39.62,22.76 40.44,21.95 40.44,21.13 40.03,20.73 40.03,19.51 41.54,18 U2.15
IO7  (via drill 0.51)
  Top 0.203: J2.11 45.72,47.14 47.75,45.11 47.75,32.11 45.72,30.07 42.47,30.07 40.03,27.64 40.03,25.2 39.22,24.38 39.22,22.35 39.62,21.95 v39.62,21.54 | v44.09,11.94 44,12.03 U2.25
  Bottom 0.203: v39.62,21.54 39.62,21.34 40.44,20.52 40.44,19.71 44.3,15.85 44.3,12.19 v44.09,11.94
IO8  (via drill 0.51)
  Top 0.203: U2.42 49.38,18.49 49.58,18.29 50.39,18.29 51.21,19.1 51.82,19.1 52.22,19.51 52.22,21.34 51.61,21.95 51.61,25.6 52.43,26.42 52.43,29.46 51.82,30.07 51.82,42.67 53.03,43.89 53.03,45.72 v51.82,46.94
  Bottom 0.203: J2.10 41.66,48.36 43.48,46.53 51.41,46.53 v51.82,46.94
IO9
  Top 0.203: J2.9 39.12,47.24 39.62,46.74 44.91,46.74 47.35,44.3 47.35,32.31 45.52,30.48 42.27,30.48 39.62,27.84 39.62,25.4 38.81,24.59 38.81,21.18 39.62,20.37 39.62,19.3 41.43,17.5 U2.16
IO11  (via drill 0.51)
  Top 0.203: U2.43 49.89,19 v49.99,19.1 | v51,20.52 51,20.93 50.8,21.13 50.8,26.01 51.61,26.82 51.61,29.06 51,29.67 51,43.69 v51.82,44.5
  Bottom 0.203: v49.99,19.1 51,20.12 v51,20.52 | J2.7 34.04,49.07 37.39,45.72 50.6,45.72 v51.82,44.5
IO12  (via drill 0.51)
  Top 0.203: J2.6 31.7,50.6 31.7,46.53 31.9,46.33 44.7,46.33 46.94,44.09 46.94,32.51 45.31,30.89 43.89,30.89 v43.48,31.29 | v51.41,17.07 51.21,17.07 50.8,17.48 48.85,17.48 U2.40
  Bottom 0.203: v51.41,17.07 51,17.48 49.78,17.48 49.17,18.09 49.17,20.12 47.55,21.74 47.55,23.98 44.91,26.62 44.91,29.87 v43.48,31.29
IO13  (via drill 0.51)
  Top 0.203: U2.41 49.26,18 49.38,17.88 51.21,17.88 v51.61,18.29 | v44.91,31.7 45.11,31.7 46.53,33.12 46.53,43.89 44.5,45.92 31.7,45.92 31.09,46.53 31.09,49.17 29.46,50.8 J2.5 | v16.87,32.72 v9.55,32.72 | IC7.5 17.48,22.35 17.07,22.76 14.28,22.76 v13.41,23.62
  Bottom 0.203: v16.87,32.72 17.48,32.72 19.3,34.54 22.96,34.54 25.4,32.11 44.5,32.11 v44.91,31.7 45.31,31.29 45.31,26.82 48.36,23.77 50.8,23.77 52.22,22.35 54.25,22.35 55.68,20.93 55.68,19.51 54.46,18.29 v51.61,18.29 | v13.41,23.62 13.41,24.38 12.39,25.4 12.39,31.09 11.79,31.7 10.57,31.7 v9.55,32.72
L13  (via drill 0.51)
  Top 0.203: R20.2 27.5,47.48 v27.84,47.14 | IC7.6 16.82,20.93 | 16.82,20.93 16.82,20.68 16.99,20.52 v18.9,20.52 | IC7.7 16.17,21.01 16.26,20.93 16.82,20.93
  Bottom 0.203: v27.84,47.14 27.84,46.13 27.03,45.31 22.15,45.31 20.32,43.48 19.51,43.48 17.88,45.11 10.57,45.11 8.53,43.08 8.53,35.76 11.63,32.72 12.19,32.72 13.21,31.7 13.21,25.81 14.43,24.59 15.04,24.59 16.05,23.57 16.87,23.57 17.88,24.59 21.34,24.59 24.18,21.74 24.18,18.09 25.6,16.66 29.06,16.66 29.46,16.26 29.46,15.24 29.26,15.04 28.25,15.04 27.43,15.85 24.99,15.85 23.16,17.68 23.16,19.3 22.35,20.12 21.74,20.12 21.34,19.71 19.71,19.71 v18.9,20.52
LINKLED  (via drill 0.51)
  Top 0.203: M1.24 26,43.29 25.4,43.89 20.32,43.89 v19.91,44.3 | R30.2 8.54,48.06 v8.99,48.46
  Bottom 0.203: v19.91,44.3 18.69,45.52 10.57,45.52 9.14,46.94 9.14,48.31 v8.99,48.46
MISO  (via drill 0.51)
  Top 0.203: U2.2 47.5,20.88 47.75,21.13 48.97,21.13 50.39,22.55 50.39,26.21 51.21,27.03 51.21,28.04 v50.8,28.65 | IC10.5 59.89,29.73 v60.15,29.46 | 63.61,30.5 ICSP.1
  Bottom 0.203: v50.8,28.65 51.21,28.65 52.43,27.43 54.25,27.43 54.86,26.82 56.69,26.82 57.1,26.42 59.33,26.42 60.15,27.23 v60.15,29.46 61.16,30.48 ICSP.1
MISO2
  Top 0.203: U1.17 27.39,24.95 28.45,26.01 28.45,26.72 ICSP1.1
MISO3  (via drill 0.51)
  Top 0.203: M1.14 24.51,29.79 24.99,30.28 26.62,30.28 27.84,31.5 27.84,33.93 28.85,34.95 28.85,35.76 28.04,36.58 v27.84,36.58 | IC10.3 54.28,30.25 53.7,29.67 v53.24,29.67 53.24,28.82 R32.2
  Bottom 0.203: v27.84,36.58 29.06,35.36 47.55,35.36 v53.24,29.67
MOSI  (via drill 0.51, 0.51 pad 0.61)
  Top 0.203: U2.1 48.98,20.32 49.38,20.73 v49.78,20.73 | v54.25,20.32 54.25,21.34 55.07,22.15 60.55,22.15 61.57,23.16 v61.57,23.77 | IC10.6 59.31,30.25 v59.74,30.68
  Bottom 0.203: v49.78,20.73 50.39,21.34 53.24,21.34 v54.25,20.32 | v61.57,23.77 61.57,24.99 63.2,26.62 64.85,26.62 ICSP.4 64.82,29.29 64.82,30.89 64.01,31.7 63.2,31.7 62.79,31.29 60.96,31.29 60.35,30.68 v59.74,30.68
MOSI2
  Top 0.203: U1.16 27.5,24.25 28.45,25.2 28.65,25.2 29.67,26.21 29.67,27.94 ICSP1.4
MOSI3  (via drill 0.51)
  Top 0.203: M1.16 26.77,33.07 27.03,33.33 27.03,36.98 v27.84,37.8 | 55,30.75 IC10.2 53.78,30.75 v53.65,30.89
  Bottom 0.203: v27.84,37.8 28.04,37.8 30.07,35.76 47.75,35.76 52.22,31.29 53.24,31.29 v53.65,30.89
N$1
  Top 0.203: R33.1 8.06,16.73 8.33,16.46 8.33,15.64 ESP-RST.A
N$2
  Top 1.016: T1.3 15.14,14.68 14.02,14.68 13.61,14.28 13.46,13.75 L4.2
N$3
  Top 0.203: BLE.A 10,48.99 R35.1
N$4
  Top 0.203: R29.1 CLOUD.A
N$6
  Top 0.203: R14.2 34.06,12.07 34.34,11.79 34.75,11.79 34.95,11.58 R13.1 35.76,10.18 35.76,7.92 36.88,6.81 38.61,6.81 38.74,6.94 R11.1 39.6,8.36 | 39.6,8.36 39.61,8.36 | 39.6,8.36 IC3.4
N$7
  Top 0.203: D4.C 33.88,13.55 33.33,13.01 33.33,11.73 R13.2
N$8  (via drill 0.51)
  Top 0.203: 23.3,11.51 IC9.8 23.3,11.6 22.94,11.6 22.76,11.79 22.35,11.79 v22.15,11.99 | v6.5,13.01 6.5,14.17 ON.A 6.61,14.63 7.06,14.63 7.32,14.88 7.32,15.85 6.91,16.26 6.3,16.26 6.06,16.5 R27.1
  Bottom 0.203: v22.15,11.99 22.15,12.19 19.71,14.63 11.38,14.63 10.77,14.02 10.77,13.01 9.96,12.19 7.52,12.19 6.71,13.01 v6.5,13.01
N$9
  Top 0.203: M1.8 16.95,28.44 Y3.P$2 16.51,25.55 C32.1
N$10
  Top 0.203: M1.9 18.16,27.56 18.49,27.23 19.71,27.23 19.91,27.03 19.91,26.14 Y3.P$1 20.49,25.55 C33.1
N$12
  Top 0.203: LINK.A 8,48.99 R30.1
N$13
  Top 0.203: R31.1 STATUS.A
N$14
  Top 0.203: TX.C 12.5,15.95 12.8,16.26 R7.2
N$15
  Top 0.203: R8.2 10.56,15.77 RX.C
N$21
  Top 0.203: L.A 29.23,47.17 28.45,47.95 28.45,48.36 28.04,48.77 27.68,48.77 R20.1
N$160
  Top 0.203: R26.2 R25.1 17.93,4 18.29,4.36 18.29,4.67 18.87,5.05 IC8.1
PWRIN
  Top 0.61: X2.9 X2.2 X2.8 | 15.47,10.72 TVS1.K
  Top 1.016: X2.9 13.32,10.7 | 13.32,10.7 TVS1.K | L4.1 13.26,10.76 13.32,10.7
RC
  Top 0.203: D4.A 35.54,14 35.97,14.43 35.97,15.47 C19.1 | R14.1 34.94,13.82 D4.A | D4.A 36.12,13 IC6.2
RD+  (via drill 0.51)
  Top 0.203: U1.29 21.64,22.25 21.54,22.35 21.13,22.35 21.03,22.25 20.62,22.25 20.52,22.35 20.22,22.35 20.02,22.15 v19.71,22.15 | v10.36,21.54 7.58,21.54 R2.2
  Bottom 0.203: v10.36,21.54 10.77,21.95 10.97,21.95 11.18,22.15 11.58,22.15 11.79,21.95 12.19,21.95 12.39,22.15 12.8,22.15 13.01,21.95 13.41,21.95 13.61,22.15 14.02,22.15 14.22,21.95 14.63,21.95 14.83,22.15 15.24,22.15 15.44,21.95 15.85,21.95 16.05,22.15 16.46,22.15 16.66,21.95 17.07,21.95 17.27,22.15 17.68,22.15 17.88,21.95 18.29,21.95 18.49,22.15 18.9,22.15 19.1,21.95 19.41,21.95 19.61,22.15 v19.71,22.15
RD-  (via drill 0.51)
  Top 0.203: U1.30 21.04,21.75 v20.62,21.34 | v9.35,22.35 7.58,22.35 R1.2
  Bottom 0.203: v20.62,21.34 20.73,22.45 20.32,22.96 19.3,22.96 18.9,22.55 9.55,22.55 v9.35,22.35
RESCOM  (via drill 0.51)
  Top 0.203: v35.76,11.79 36.37,11.18 36.37,9.55 36.42,9.5 IC3.2 | IC2.2 32.44,13.89 v32.44,14.43 R5.2 33.79,15.7 34.95,16.87 34.95,18.32 D2.C 35.15,18.47
  Bottom 0.203: v35.76,11.79 34.14,11.79 33.12,12.8 33.12,13.75 v32.44,14.43
RESET16U2  (via drill 0.51)
  Top 0.203: U1.24 22.75,25.59 v22.76,26.01 | ICSP1.5 34.43,26.73 35.54,25.42 35.54,25.22 36.37,24.38 36.37,23.96 R3.1 36.62,23.71 D1.A
  Bottom 0.203: v22.76,26.01 23.57,25.2 26.42,25.2 27.23,24.38 32.72,24.38 33.53,25.2 33.53,26.72 ICSP1.5
RSTBTN  (via drill 0.51)
  Top 0.203: RESET.2 3,49.33 v3.05,49.38 | IC2.3 29.9,14.4 29.67,14.63 29.67,15.39 C7.2 28.8,15.7 v28.65,15.85
  Bottom 0.203: v3.05,49.38 3.05,48.97 4.27,47.75 7.52,47.75 9.14,46.13 9.14,44.3 8.13,43.28 8.13,35.36 11.33,32.26 12.04,32.26 12.8,31.5 12.8,25.6 14.22,24.18 14.83,24.18 15.85,23.16 17.07,23.16 18.09,24.18 20.73,24.18 22.15,22.76 22.15,20.93 23.77,19.3 23.77,17.88 25.4,16.26 28.25,16.26 v28.65,15.85
RXLED  (via drill 0.51)
  Top 0.203: R8.1 11.21,17 v11.75,16.46 | U1.10 27.55,21.25 27.62,21.33 28.46,21.33 29.06,20.73 29.06,20.12 28.85,19.91 28.85,18.29 27.23,16.66 v27.23,13.82
  Bottom 0.203: v11.75,16.46 11.73,16.46 12.34,17.07 15.85,17.07 16.26,16.66 21.34,16.66 23.37,14.63 26.42,14.63 v27.23,13.82
SCK  (via drill 0.51, 0.51 pad 0.61)
  Top 0.203: U2.3 47,20.99 47.55,21.54 48.77,21.54 49.99,22.76 49.99,27.03 v50.39,27.43 | 54.92,25.75 IC11.3 56.03,25.75 v56.29,26.01
  Bottom 0.203: v50.39,27.43 50.8,27.03 53.85,27.03 54.46,26.42 55.88,26.42 v56.29,26.01 59.54,26.01 61.47,27.94 ICSP.3
SCK2
  Top 0.203: U1.15 27.81,23.75 28.85,24.79 29.06,24.79 ICSP1.3
SCK3  (via drill 0.51)
  Top 0.203: v27.84,35.36 27.84,34.75 27.43,34.34 27.43,31.7 26.42,30.68 23.77,30.68 23.37,30.28 23.37,29.03 M1.13 23.24,28.73 | IC11.5 57.74,24.82 v57.71,24.38
  Bottom 0.203: v27.84,35.36 28.25,34.95 47.35,34.95 48.26,34.04 48.26,28.35 49.99,26.62 53.65,26.62 55.07,25.2 56.9,25.2 v57.71,24.38
SCL  (via drill 0.51)
  Top 0.203: v44.55,37.8 44.5,37.59 43.89,37.59 42.67,36.37 42.67,33.33 40.23,30.89 40.23,29.06 39.22,28.04 39.22,25.6 38.41,24.79 38.41,20.98 37.8,20.37 37.8,19.51 38,19.3 38,17.48 | U2.19 41.2,16 41.2,15.95 40.13,15.95 39.83,15.65 38.81,15.65 38,16.46 38,17.48 | R21.1 38.02,17.5 38,17.48
  Bottom 0.203: J2.1 18.8,49.89 20.12,48.56 30.07,48.56 31.9,46.74 31.9,44.7 33.12,43.48 33.12,40.84 33.33,40.64 33.33,38.81 34.75,37.39 43.89,37.39 44.3,37.8 v44.55,37.8
SDA  (via drill 0.51)
  Top 0.203: v43.69,38.81 43.69,38 42.27,36.58 42.27,33.53 39.83,31.09 39.83,29.26 38.81,28.25 38.81,25.81 38,24.99 38,21.18 37.13,20.32 R19.1 37.13,19.5 37.59,19.04 37.59,16.26 38.61,15.24 40.23,15.24 40.54,15.54 41.55,15.54 41.55,15.5 U2.20
  Bottom 0.203: J2.2 23.16,48.97 30.48,48.97 32.31,47.14 32.31,44.91 33.53,43.69 33.53,41.05 33.73,40.84 33.73,39.01 34.54,38.2 36.78,38.2 37.19,37.8 42.88,37.8 v43.69,38.81
SDCD  (via drill 0.51)
  Top 0.203: R34.2 59.56,10.18 59.94,10.57 v60.96,10.57 | X3.P10 53.75,16.57 v53.85,16.66 | v21.95,39.83 21.95,34.75 22.35,34.34 22.55,34.34 23.37,33.53 23.37,32.31 22.55,31.5 v21.54,31.5 | M1.6 14.43,28.58 14.43,30.12 v15.19,30.89
  Bottom 0.203: v53.85,16.66 53.85,16.05 54.66,15.24 55.68,15.24 56.29,14.63 56.29,14.02 56.69,13.61 57.1,13.61 59.54,11.18 60.35,11.18 v60.96,10.57 61.98,11.58 61.98,13.82 61.16,14.63 61.16,16.26 60.35,17.07 60.35,20.12 56.08,24.38 53.24,24.38 51.82,25.81 49.48,25.81 47.45,27.84 47.45,33.63 46.94,34.14 27.03,34.14 26.62,34.54 26.62,36.78 25.4,38 23.22,38 21.95,39.27 | 21.95,39.22 21.95,39.27 | 21.95,39.27 v21.95,39.83 | v21.54,31.5 17.88,31.5 17.27,30.89 v15.19,30.89
SDCS  (via drill 0.51)
  Top 0.203: M1.29 19.3,46.37 19.3,45.72 19.1,45.52 19.1,44.7 18.9,44.5 18.9,43.69 19.51,43.08 20.73,43.08 21.13,43.48 23.37,43.48 24.28,42.57 24.28,41.1 23.98,40.79 23.98,35.76 v23.57,35.36 | X3.P2 58.38,17.94 58.12,18.21 v58.12,18.49
  Bottom 0.203: v58.12,18.49 58.52,18.9 58.52,19.51 55.27,22.76 52.43,22.76 51,24.18 48.67,24.18 45.82,27.03 45.82,32.21 45.52,32.51 25.6,32.51 23.57,34.54 v23.57,35.36
SDMISO  (via drill 0.51)
  Top 0.203: M1.31 16.87,46.48 16.87,44.91 15.65,43.69 v15.65,43.08 | X3.P7 64.77,12.44 64.41,12.8 62.38,12.8 61.77,13.41 60.96,13.41 v60.76,13.61
  Bottom 0.203: v60.76,13.61 60.76,15.85 59.74,16.87 59.74,20.12 55.88,23.98 53.03,23.98 51.61,25.4 49.28,25.4 47.04,27.64 47.04,33.43 46.74,33.73 26.42,33.73 26.21,33.93 26.21,36.37 25.04,37.54 23.01,37.54 20.12,40.44 20.12,41.25 17.48,43.89 16.46,43.89 v15.65,43.08
SDMOSI  (via drill 0.51)
  Top 0.203: v58.12,16.66 58.64,16.66 58.82,16.84 X3.P3 | v11.58,42.47 9.27,44.78 M1.37 9.27,46.2
  Bottom 0.203: v58.12,16.66 58.12,16.87 58.93,17.68 58.93,19.71 55.47,23.16 52.63,23.16 51.21,24.59 48.87,24.59 46.23,27.23 46.23,32.61 45.92,32.92 26.01,32.92 25.4,33.53 25.4,35.76 24.54,36.63 21.29,36.63 20.52,37.39 17.17,37.39 12.09,42.47 v11.58,42.47
SDSCK  (via drill 0.51)
  Top 0.203: v59.74,15.24 59.92,15.26 61.35,15.26 61.96,14.64 X3.P5 | M1.30 18.09,46.42 18.09,44.5 16.87,43.28 v16.87,43.08
  Bottom 0.203: v59.74,15.24 59.33,15.65 59.33,19.91 55.68,23.57 52.83,23.57 51.41,24.99 49.07,24.99 46.63,27.43 46.63,33.02 46.33,33.33 26.21,33.33 25.81,33.73 25.81,36.17 24.89,37.08 22.86,37.08 19.51,40.44 19.51,41.25 17.68,43.08 v16.87,43.08
SPIEN  (via drill 0.51 pad 0.61)
  Top 0.203: v21.23,40.84 20.93,40.54 20.93,34.75 21.74,33.93 22.15,33.93 22.96,33.12 22.96,32.72 22.55,32.31 20.52,32.31 20.32,32.11 20.32,31.09 20.7,30.71 M1.11 | 56.96,30.75 56.83,30.75 56.33,31.25 IC10.1 54.5,31.25 54.06,31.7 R36.2 53.45,32.5 v53.03,32.92 | IC10.7 56.96,30.75 | 56.96,30.75 56.69,30.48 v56.69,29.67 | IC11.7 58.76,26.25 59.13,26.62 59.13,27.13 v58.52,27.74
  Bottom 0.203: v53.03,32.92 52.43,32.92 48.36,36.98 34.54,36.98 32.72,38.81 32.72,41.05 30.07,43.69 22.35,43.69 21.23,42.57 v21.23,40.84 | v56.69,29.67 56.69,29.46 56.79,29.46 v58.52,27.74
SS  (via drill 0.51)
  Top 0.203: U2.44 49.17,19.51 49.58,19.91 50.39,19.91 50.8,19.51 51.41,19.51 51.82,19.91 51.82,20.93 51.21,21.54 51.21,25.81 52.02,26.62 52.02,29.26 51.41,29.87 51.41,42.88 52.63,44.09 52.63,44.91 v51.82,45.72
  Bottom 0.203: J2.8 36.58,48.77 39.22,46.13 51.41,46.13 v51.82,45.72
STATUSLED
  Top 0.203: 19.43,28.93 M1.10 19.43,29.74 18.9,30.28 17.07,30.28 16.66,30.68 16.66,31.45 16,32.11 10.57,32.11 9.96,31.5 9.14,31.5 8.74,31.9 7.32,31.9 7.11,32.11 7.11,46.74 6,47.85 R31.2
SW
  Top 0.203: IC8.4 18.95,3.1 18.29,2.44 18.29,2.23 19.04,2.23 IC8.5
  pour Top: 20.32,3.45 20.32,0.81 18.69,0.81 18.29,1.22 18.29,3.25 18.49,3.45
TOUCH  (via drill 0.9 pad 2.18)
  Top 0.203: M1.12 21.97,28.02 22.35,27.64 25.2,27.64 25.4,27.84 25.4,29.46 25.81,29.87 26.82,29.87 28.25,31.29 28.25,33.53 30.07,35.36 30.07,36.28 TP1.1
  other vias: 31,37.21
TXLED  (via drill 0.51)
  Top 0.203: U1.11 28.64,21.75 29.46,20.93 29.46,19.91 29.26,19.71 29.26,18.09 27.84,16.66 27.84,15.04 28.25,14.63 v28.25,13.01 | v14.52,16.05 13.69,16.88 R7.1
  Bottom 0.203: v28.25,13.01 26.82,13.01 25.6,14.22 22.96,14.22 20.93,16.26 14.72,16.26 v14.52,16.05
UGND  (via drill 0.51)  (1 unrouted)
  Top 0.203: U1.28 21.8,22.75 21.74,22.81 20.8,22.8 C3.2 18.71,23.55 v18.49,23.37
  Top 0.406: X1.P5 5.11,20.9 5.28,20.73 5.28,20.32 6.1,19.51 7.59,19.51 L1.1 10.97,18.49 10.78,18.5 v10.75,18.7
  Bottom 0.203: v18.49,23.37 20.52,23.57 21.54,22.55 21.54,20.73 21.13,20.32 20.32,20.32 19.3,21.34 17.88,21.34 16.46,19.91 13.61,19.91 13.21,19.51 12.65,18.9 12.24,18.9 | 10.96,18.9 11.34,18.9 11.24,19
  Bottom 1.016: 12.24,18.9 10.96,18.9 v10.75,18.7
USBVCC
  Top 0.203: U1.31 22.03,21.23 21.64,21.23 20.95,20.55 20.09,20.55 17.48,23.16 15.85,23.16 14.58,24.43 12.75,24.43 12.6,24.59 10.77,24.59
  Top 0.305: F1.1 10.5,24.86
  Top 0.61: 10.5,24.86 10.77,24.59 10.77,22.76 11.58,21.95 11.79,21.95 11.98,21.75 T2.3
USHIELD  (via drill 0.51)
  Top 0.305: C1.2 0.99,26.13 X1.P$3
  Top 0.406: Z1.2 8.5,19.95 8.74,19.71 v9.35,19.71 | Z2.2 8.98,23.98 v9.35,23.98
  Top 0.813: X1.S4 4.45,19.74 4.67,19.71 5.93,18.5 L1.2
  Bottom 0.406: X1.S3 4.75,24.71 5.49,23.98 v9.35,23.98 | 4.06,19.71 v9.35,19.71
  pour Top: -1.02,27.03 2.67,27.03 4.67,25.03 4.67,19.48 2.67,17.48 -1.02,17.48
  pour Bottom: -2.03,27.03 2.67,27.03 4.67,25.03 4.67,19.48 2.67,17.48 -2.03,17.48
VUCAP
  Top 0.203: U1.27 21.25,23.25 20.93,23.57 20.93,23.98 20.52,24.38 20.06,24.38 C3.1
XT1
  Top 0.203: U1.1 22.75,18.2 R4.1 22.55,17.86 23.57,16.85 23.57,15.8 Y1.1 21.37,14.56 C6.1
XT2
  Top 0.203: U1.2 23.25,18.2 R4.2 23.45,17.63 Y1.3 25.52,16.43 C5.1
XTAL1
  Top 0.203: 44.56,23.8 Y2.1 | C16.1 44.71,24.03 Y2.1 | Y2.1 44.33,23.57 44.09,23.57 43.56,23.03 R12.1 43.48,22.73 43.48,22.15 44.5,21.13 U2.8
XTAL2
  Top 0.203: C15.1 47.66,25.93 Y2.3 46.17,24.96 46.17,23.52 45.82,23.16 44.81,23.16 R12.2 44.3,22.65 44.3,21.95 45,21.24 U2.7
XUSB  (via drill 0.51)
  Top 0.305: 9.25,26.62 v9.03,26.62
  Top 0.406: X1.P1 3.3,23.55 3.3,23.57 3.28,23.57
  Top 0.61: 3.28,23.57 2.85,24 2.85,26.01 2.92,26.09 v2.92,26.42 | 9.25,26.62 8.63,26 F1.2 | v2.92,26.42 2.94,26.51 | C1.1 2.92,27.62 v2.92,26.42
  Bottom 0.813: 8.74,26.62 7.72,27.64 3.86,27.64 2.92,26.7 v2.92,26.42
  Bottom 1.016: v9.03,26.62 8.74,26.62

## Text on the board
Bottom: WiFi 32 R01
tNames: AREF | GND | 13 | 12 | 11 | 10 | 9 | 8 | 7 | 6 | 5 | 4 | 3 | 2 | 1 | 0 | # | # | # | # | SCL | SDA | # | # | DIGITAL | TX | RX | CHECK | FLUO WiFi | ITALY | MADE IN | R01 | 1 | 1 | ANALOG IN | 6-20V | RFU | IOREF | RESET | 3V3 | 5V | GND | VIN | A0 | A1 | A2 | A3 | A4 | A5
DrillLegend: LAYER-STACK
DrillLegend_01-16: 01-16
DrillLegend_01-20: 01-20
214bmp: D:/SmartProjects/Snc/a4_bn_logo2.bmp